# Altium schematic sheet main.SchDoc
size A4; SheetNumber: 1; SheetTotal: 1
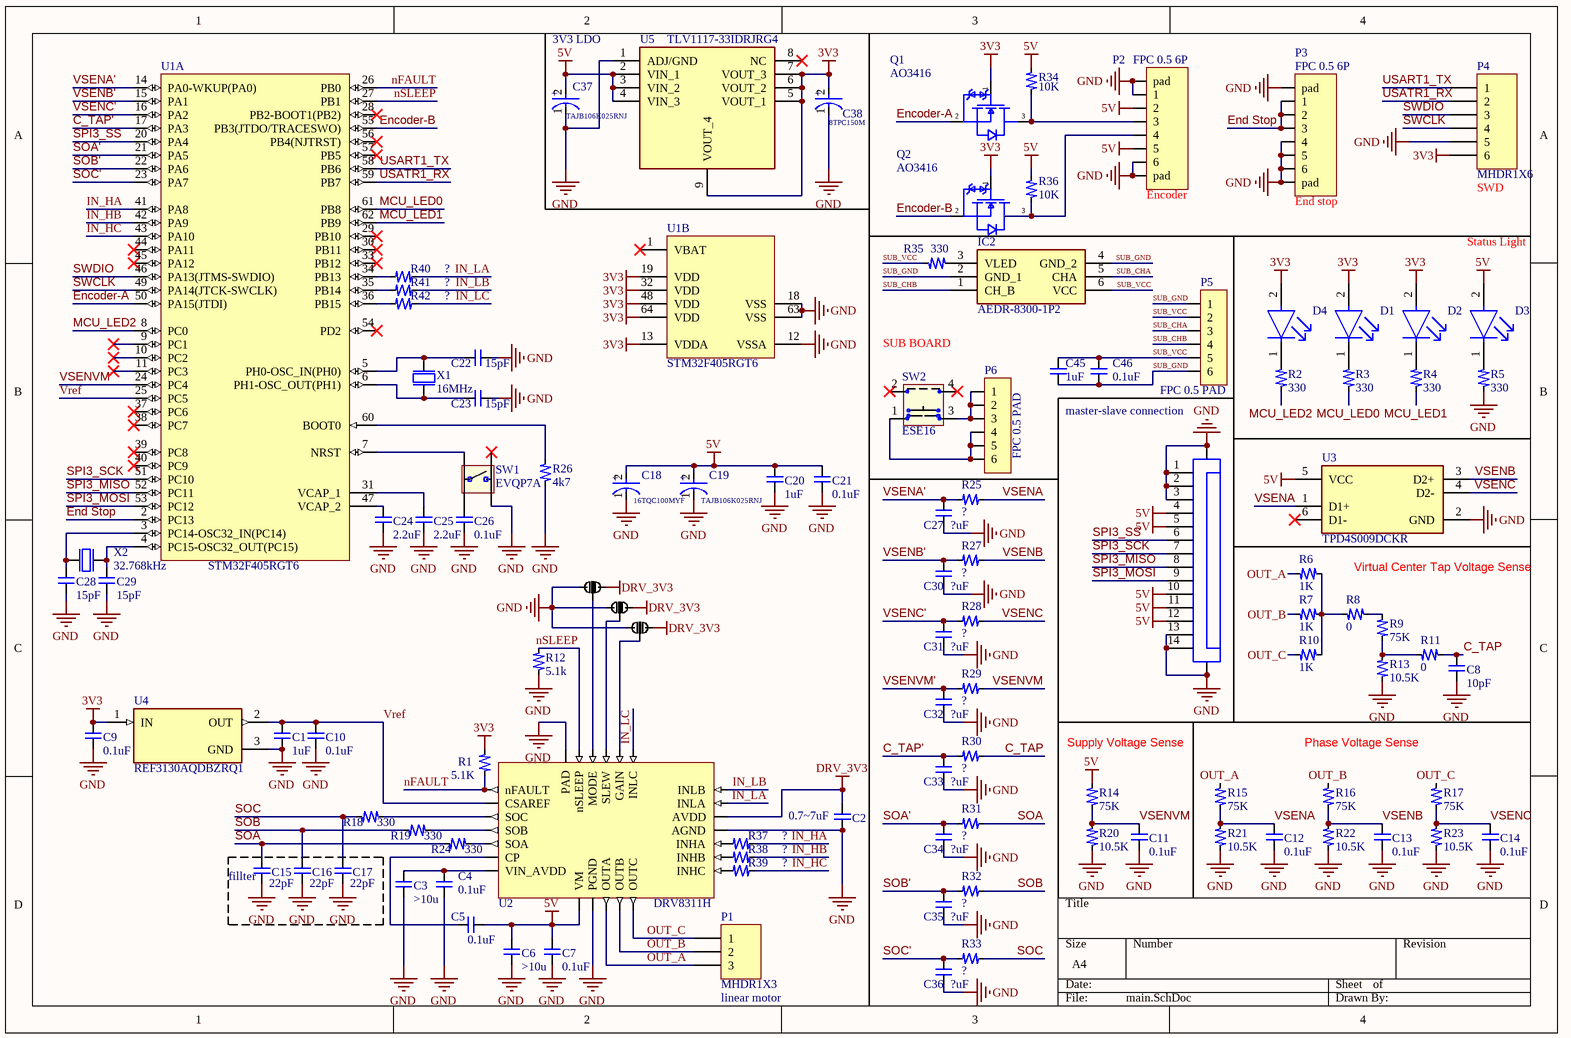
[diagram p0: main.SchDoc]

## Parts
C1  1uF  [0402 R]
C2  0.7~7uF  [0603 R]
C3  >10u  [0603 R]
C4  0.1uF  [0402 R]
C5  0.1uF  [0402 R]
C6  >10u  [0603 R]
C7  0.1uF  [0402 R]
C8  10pF  [0201 R]
C9  0.1uF  [0402 R]
C10  0.1uF  [0402 R]
C11  0.1uF  [0402 R]
C12  0.1uF  [0402 R]
C13  0.1uF  [0402 R]
C14  0.1uF  [0402 R]
C15  22pF  [0201 R]
C16  22pF  [0201 R]
C17  22pF  [0201 R]
C18  16TQC100MYF  [FP-POSCAP-D2-MFG]
C19  TAJB106K025RNJ  [FP-TAJB-MFG]
C20  1uF  [0603 R]
C21  0.1uF  [0402 R]
C22  15pF  [0201 R]
C23  15pF  [0201 R]
C24  2.2uF  [0402 R]
C25  2.2uF  [0402 R]
C26  0.1uF  [0402 R]
C27  ?uF  [0201 R]
C28  15pF  [0201 R]
C29  15pF  [0201 R]
C30  ?uF  [0201 R]
C31  ?uF  [0201 R]
C32  ?uF  [0201 R]
C33  ?uF  [0201 R]
C34  ?uF  [0201 R]
C35  ?uF  [0201 R]
C36  ?uF  [0201 R]
C37  TAJB106K025RNJ  [FP-TAJB-MFG]
C38  8TPC150M  [FP-POSCAP-D2-MFG]
C45  1uF  [0402 R]
C46  0.1uF  [0402 R]
D1  APHHS1005CGCK  [FP-APHHS1005CGCK-MFG]  (value not drawn)
D2  APHHS1005CGCK  [FP-APHHS1005CGCK-MFG]  (value not drawn)
D3  APHHS1005CGCK  [FP-APHHS1005CGCK-MFG]  (value not drawn)
D4  APHHS1005CGCK  [FP-APHHS1005CGCK-MFG]  (value not drawn)
IC2  AEDR-8300-1P2  [AEDR83001P2]
J1  68711414522  [68711414522]  (value not drawn)
P1  MHDR1X3  [MHDR1X3]
P2  FPC 0.5 6P  [FPC 6P 0.5mm]
P3  FPC 0.5 6P  [FPC 6P 0.5mm]
P4  MHDR1X6  [MHDR1X6]
P5  FPC 0.5 PAD  [FPC 6P 0.5mm PAD]
P6  FPC 0.5 PAD  [FPC 6P 0.5mm PAD]
Q1  AO3416  [SOT23-3]
Q2  AO3416  [SOT23-3]
R1  5.1K  [0201 R]
R2  330  [0402 R]
R3  330  [0402 R]
R4  330  [0402 R]
R5  330  [0402 R]
R6  1K  [0201 R]
R7  1K  [0201 R]
R8  0  [0201 R]
R9  75K  [0201 R]
R10  1K  [0201 R]
R11  0  [0201 R]
R12  5.1k  [0201 R]
R13  10.5K  [0201 R]
R14  75K  [0201 R]
R15  75K  [0201 R]
R16  75K  [0201 R]
R17  75K  [0201 R]
R18  330  [0402 R]
R19  330  [0402 R]
R20  10.5K  [0201 R]
R21  10.5K  [0201 R]
R22  10.5K  [0201 R]
R23  10.5K  [0201 R]
R24  330  [0402 R]
R25  ?  [0201 R]
R26  4k7  [0201 R]
R27  ?  [0201 R]
R28  ?  [0201 R]
R29  ?  [0201 R]
R30  ?  [0201 R]
R31  ?  [0201 R]
R32  ?  [0201 R]
R33  ?  [0201 R]
R34  10K  [0402 R]
R35  330  [0402 R]
R36  10K  [0402 R]
R37  ?  [0201 R]
R38  ?  [0201 R]
R39  ?  [0201 R]
R40  ?  [0201 R]
R41  ?  [0201 R]
R42  ?  [0201 R]
SP1  short_pad  [short_pad_3]  (value not drawn)  (part B of 2)
SP2  short_pad  [short_pad_3]  (value not drawn)  (part B of 2)
SP3  short_pad  [short_pad_3]  (value not drawn)  (part B of 2)
SW1  EVQP7A  [EVQP7A - duplicate]
SW2  ESE16  [ESE16 Switches]
U1  STM32F405RGT6  [STM-LQFP64_M]  (parts A,B of 2)
U2  DRV8311H  [WQFN24]
U3  TPD4S009DCKR  [FP-DCK0006A-MFG]
U4  REF3130AQDBZRQ1  [FP-DBZ0003A-IPC_B]
U5  TLV1117-33IDRJRG4  [SON80P400X400X80-9N-D]
X1  16MHz  [BT-XTAL_2016]
X2  32.768kHz  [XTAL_3215]

## Blocks framed on the sheet
fillter: C15-C17

## Nets
3V3: C9.1 C38.2(A) D1.2(A) D2.2(A) D4.2(A) P4.6 Q1.1(G) Q2.1(G) R1.1 U1.13(VDDA) U1.19(VDD) U1.32(VDD) U1.48(VDD) U1.64(VDD) U4.1(IN) U5.5(VOUT_1) U5.6(VOUT_2) U5.7(VOUT_3) U5.9(VOUT_4)
5V: C5.1 C6.1 C7.1 C18.2(A) C19.2(A) C20.1 C21.1 C37.2(A) D3.2(A) J1.4 J1.5 J1.10 J1.11 J1.12 P2.2 P2.5 R14.1 R34.2 R36.2 U2.8(VM) U3.5(VCC) U5.2(VIN_1) U5.3(VIN_2) U5.4(VIN_3)
DRV_3V3: C2.2 SP1.1 SP2.1 SP3.1 U2.17(AVDD)
GND: C1.2 C2.1 C3.2 C4.2 C6.2 C7.2 C8.2 C9.2 C10.2 C11.2 C12.2 C13.2 C14.2 C15.2 C16.2 C17.2 C18.1(C) C19.1(C) C20.2 C21.2 C22.2 C23.2 C24.1 C25.1 C26.1 C27.1 C28.2 C29.2 C30.1 C31.1 C32.1 C33.1 C34.1 C35.1 C36.1 C37.1(C) C38.1(C) J1.1 J1.2 J1.3 J1.13 J1.14 J1.M1 J1.M2 P2.0(pad) P2.1 P2.6 P2.7(pad) P3.0(pad) P3.4 P3.5 P3.6 P3.7(pad) P4.5 R5.1 R12.1 R13.2 R20.2 R21.2 R22.2 R23.2 R26.2 SP1.3 SP2.3 SP3.3 SW1.1 U1.12(VSSA) U1.18(VSS) U1.63(VSS) U2.9(PGND) U2.16(AGND) U2.25(PAD) U3.2(GND) U4.3(GND) U5.1(ADJ/GND) X1.2(GND) X1.4(GND)
C_TAP: C8.1 R11.2 R30.2
C_TAP': C33.2 R30.1 U1.17(PA3)
Encoder-A: Q1.2(S) U1.50(PA15(JTDI))
Encoder-B: Q2.2(S) U1.55(PB3(JTDO/TRACESWO))
End Stop: P3.1 P3.2 P3.3 U1.2(PC13)
IN_HA: R37.2 U1.41(PA8)
IN_HB: R38.2 U1.42(PA9)
IN_HC: R39.2 U1.43(PA10)
IN_LA: R40.2 U2.18(INLA)
IN_LB: R41.2 U2.19(INLB)
IN_LC: R42.2 U2.20(INLC)
MCU_LED0: R3.1 U1.61(PB8)
MCU_LED1: R4.1 U1.62(PB9)
MCU_LED2: R2.1 U1.8(PC0)
nFAULT: R1.2 U1.26(PB0) U2.1(nFAULT)
nSLEEP: R12.2 U1.27(PB1) U2.24(nSLEEP)
OUT_A: P1.3 R6.1 R15.1 U2.10(OUTA)
OUT_B: P1.2 R7.1 R16.1 U2.11(OUTB)
OUT_C: P1.1 R10.1 R17.1 U2.12(OUTC)
SOA: C15.1 R24.1 R31.2
SOA': C34.2 R31.1 U1.21(PA5)
SOB: C16.1 R19.1 R32.2
SOB': C35.2 R32.1 U1.22(PA6)
SOC: C17.1 R18.1 R33.2
SOC': C36.2 R33.1 U1.23(PA7)
SPI3_MISO: J1.8 U1.52(PC11)
SPI3_MOSI: J1.9 U1.53(PC12)
SPI3_SCK: J1.7 U1.51(PC10)
SPI3_SS: J1.6 U1.20(PA4)
SUB_CHA: IC2.5(CHA) P5.3
SUB_CHB: IC2.1(CH_B) P5.4
SUB_GND: C45.2 C46.2 IC2.2(GND_1) IC2.4(GND_2) P5.1 P5.6
SUB_VCC: C45.1 C46.1 IC2.6(VCC) P5.2 P5.5 R35.2
SWCLK: P4.4 U1.49(PA14(JTCK-SWCLK))
SWDIO: P4.3 U1.46(PA13(JTMS-SWDIO))
USART1_TX: P4.1 U1.58(PB6)
USATR1_RX: P4.2 U1.59(PB7)
Vref: C1.1 C10.1 U1.25(PC5) U2.2(CSAREF) U4.2(OUT)
VSENA: C12.1 R15.2 R21.1 R25.2 U3.1(D1+)
VSENA': C27.2 R25.1 U1.14(PA0-WKUP(PA0))
VSENB: C13.1 R16.2 R22.1 R27.2 U3.3(D2+)
VSENB': C30.2 R27.1 U1.15(PA1)
VSENC: C14.1 R17.2 R23.1 R28.2 U3.4(D2-)
VSENC': C31.2 R28.1 U1.16(PA2)
VSENVM: C11.1 R14.2 R20.1 R29.2
VSENVM': C32.2 R29.1 U1.24(PC4)
NetC3_1: C3.1 C4.1 U2.7(VIN_AVDD)
NetC5_2: C5.2 U2.6(CP)
NetC22_1: C22.1 U1.5(PH0-OSC_IN(PH0)) X1.3(out)
NetC23_1: C23.1 U1.6(PH1-OSC_OUT(PH1)) X1.1(inp)
NetC24_2: C24.2 U1.47(VCAP_2)
NetC25_2: C25.2 U1.31(VCAP_1)
NetC26_2: C26.2 SW1.4
NetC28_1: C28.1 U1.3(PC14-OSC32_IN(PC14)) X2.1(inp)
NetC29_1: C29.1 U1.4(PC15-OSC32_OUT(PC15)) X2.2(out)
NetD1_1: D1.1(C) R3.2
NetD2_1: D2.1(C) R4.2
NetD3_1: D3.1(C) R5.2
NetD4_1: D4.1(C) R2.2
NetIC2_3: IC2.3(VLED) R35.1
NetP2_3: P2.3 Q1.3(D) R34.1
NetP2_4: P2.4 Q2.3(D) R36.1
NetP6_1: P6.1 P6.2 P6.3 SW2.3(Separate_N.O)
NetP6_4: P6.4 P6.5 P6.6 SW2.1(Com_N.O)
NetR6_2: R6.2 R7.2 R8.1 R10.2
NetR8_2: R8.2 R9.1
NetR9_2: R9.2 R11.1 R13.1
NetR18_2: R18.2 U2.3(SOC)
NetR19_2: R19.2 U2.4(SOB)
NetR24_2: R24.2 U2.5(SOA)
NetR26_1: R26.1 U1.60(BOOT0)
NetR37_1: R37.1 U2.15(INHA)
NetR38_1: R38.1 U2.14(INHB)
NetR39_1: R39.1 U2.13(INHC)
NetR40_1: R40.1 U1.34(PB13)
NetR41_1: R41.1 U1.35(PB14)
NetR42_1: R42.1 U1.36(PB15)
NetSP1_2: SP1.2 U2.21(GAIN)
NetSP2_2: SP2.2 U2.23(MODE)
NetSP3_2: SP3.2 U2.22(SLEW)
NetSW1_3: SW1.3 U1.7(NRST)

Not connected (* = marked no-connect by the designer): SW1 2*; SW2 2(Dummy_N.C)* 4(Dummy_N.C)*; U1 1(VBAT)* 9(PC1)* 10(PC2)* 11(PC3)* 28(PB2-BOOT1(PB2))* 29(PB10)* 30(PB11)* 33(PB12)* 37(PC6)* 38(PC7)* 39(PC8)* 40(PC9)* 44(PA11)* 45(PA12)* 54(PD2)* 56(PB4(NJTRST))* 57(PB5)*; U3 6(D1-)*; U5 8(NC)*

## Notes on the sheet
- 3V3 LDO
- (near P2) Encoder
- (near P3) End stop
- (near P4) SWD
- Status Light
- SUB BOARD
- master-slave connection
- Virtual Center Tap Voltage Sense
- Supply Voltage Sense
- Phase Voltage Sense
- (near P1) linear motor
- (in symbol CMP-04424-000481-1) +
- (in symbol CMP-05428-000421-1) +
- (in symbol CMP-05428-000823-1) +

## Library data of the parts
C1-C5 C7-C17 C20-C36 C45 C46 = Capacitors
C6 = Capacitors: 有極性電容
C18 = CMP-05428-000823-1: Molded Tantalum Polymer Capacitor 100uF 20% 16V life 2000Hours SMD 2917; Ripple Current: 1.8A; ESR (Equivalent Series Resistance): 50mR; Dissipation Factor: 10%; Polarity: Polar; Leakage Current: 160uA; Voltage: 16V; Min Operating Temperature: -55°C; Width: 4.3mm; Package Quantity: 3000; Construction: Flat; Life (Hours): 2000Hour; Packaging: Tape and Reel; Height: 1.9mm; Radiation Hardening: No; Depth: 4.3mm; Features: General Purpose; RoHS Compliant: Yes; Voltage Rating (DC): 16V; Tolerance: 20%; Capacitance: 100uF; Case Code (Metric): 7343; Length: 7.3mm; Case Code (Imperial): 2917; Number of Pins: 2; Mount: Surface Mount; Series: POSCAP™ TQC; Height - Seated (Max): 0.079inch; Lead Free: Lead Free; Termination: SMD/SMT; REACH SVHC: No SVHC; Case/Package: 2917; Voltage Rating: 16V; Material: Polymer; Max Operating Temperature: 105°C
C19 C37 = CMP-04424-000481-1: 10uF 25V  ±10% 2.5Ω 1210  SMD Tantalum Capacitor; ESR (Equivalent Series Resistance): 2.5R; Polarity: Polar; Dissipation Factor: 6%; Leakage Current: 2.5uA; Lead Free: Lead Free; Capacitance: 10uF; Voltage Rating: 25V; Mount: Surface Mount; Packaging: Tape and Reel; Min Operating Temperature: -55°C; Weight: 0.000564oz; Series: TAJ; Case/Package: 1210; Width: 0.11inch; Height - Seated (Max): 0.083inch; RoHS Compliant: Yes; Height: 2.1mm; Depth: 2.8mm; Radiation Hardening: No; Construction: Flat; Max Operating Temperature: 125°C; Voltage Rating (DC): 25V; Features: General Purpose; REACH SVHC: No SVHC; Tolerance: 10%; Package Quantity: 1; Case Code (Metric): 3528; Termination: SMD/SMT; Case Code (Imperial): 1210; Length: 3.5mm
C38 = CMP-05428-000421-1: Molded Tantalum Polymer Capacitor 150uF 20% 8V life 2000Hours SMD 2917; Ripple Current: 1.9A; Polarity: Polar; Dissipation Factor: 10%; ESR (Equivalent Series Resistance): 40mR; Leakage Current: 120uA; Capacitance: 150uF; Voltage Rating: 8V; Tolerance: 20%; Min Operating Temperature: -55°C; Lead Free: Lead Free; Package Quantity: 3000; Packaging: Tape and Reel; Case Code (Metric): 7343; Width: 4.3mm; Case Code (Imperial): 2917; Height: 1.9mm; Height - Seated (Max): 0.079inch; Construction: Flat; Number of Pins: 2; Series: POSCAP™ TPC; REACH SVHC: No SVHC; Radiation Hardening: No; Termination: SMD/SMT; Voltage Rating (DC): 8V; Voltage: 8V; Length: 7.3mm; RoHS Compliant: Yes; Features: General Purpose; Case/Package: 2917; Depth: 4.3mm; Mount: Surface Mount; Max Operating Temperature: 105°C
D1-D4 = CMP-44529-000044-1: LED GREEN CLEAR CHIP SMD; Viewing Angle: 120°; Dominant Wavelength: 570nm; Test Current: 20mA; Luminous Intensity: 50mcd; Forward Voltage: 2.1V; Number of LEDs: 1; Lens Color: Clear; Packaging: Tape and Reel; Max Operating Temperature: 85°C; Illumination Color: Green; Length: 1mm; Mount: Surface Mount; Lens Style: Clear; Color: Green; Number of Pins: 2; Wavelength: 570nm; Case/Package: 0402; Width: 0.5mm; Package Quantity: 2000; Case Code (Metric): 1005; Height: 0.6mm; Lead Free: Lead Free; Case Code (Imperial): 0402; Forward Current: 20mA; Min Operating Temperature: -40°C
IC2 = AEDR-8300-1P2: Integrated Circuit; Manufacturer_Name: Avago Technologies; Datasheet Link: https://docs.broadcom.com/docs/AV02-0088EN; Height: 1.78mm; Manufacturer_Part_Number: AEDR-8300-1P2; Mouser Part Number: 630-AEDR-8300-1P2; Mouser Price/Stock: https://www.mouser.com/Search/Refine.aspx?Keyword=630-AEDR-8300-1P2
J1 = CMP-1502-01531-2: NexarPartId: 8917692; Contact Resistance: 20mΩ; Number of Positions: 14; Contact Location: Bottom; Operating Supply Voltage: 50V; Actuator Material: Liquid Crystal Polymer, Polymer; Pitch: 500µm; Current Rating: 500mA; Insulation Resistance: 100MΩ; Gender: Male; Number of Contacts: 14; Packaging: Tape and Reel; Number of Pins: 14; Termination: Solder; Contact Material: Bronze, Tin; Lead Pitch: 500µm; Contact Plating: Tin; Housing Material: Liquid Crystal Polymer; Flammability Rating: UL94 V-0; RoHS: Compliant; REACH SVHC: No SVHC; Orientation: Horizontal; Min Operating Temperature: -25°C; Width: 2.1mm; Max Operating Temperature: 85°C; Number of Rows: 1; Mount: Surface Mount; Length: 13.4mm; Voltage Rating: 50V
P1 = MHDR1X3: Header, 3-Pin; LatestRevisionDate: 17-Jul-2002; LatestRevisionNote: Re-released for DXP Platform.; Publisher: Altium Limited
P2 P3 = FPC_6P_0.5_Connectors
P4 = MHDR1X6: Header, 6-Pin; LatestRevisionDate: 17-Jul-2002; LatestRevisionNote: Re-released for DXP Platform.; Publisher: Altium Limited
P5 P6 = FPC_6P_0.5_PAD
R1-R42 = Resistors
SW1 = EVQP7A Side-operational Switches
SW2 = ESE16 Detector Switches
U1 = CMP-0243-00019-3: ARM Cortex-M4 32-bit MCU+FPU, 210 DMIPS, 1024 kB Flash, 192 kB Internal RAM, 51 I/Os, 64-pin LQFP, -40 to 85 degC, Tray; Manufacturer: STMicroelectronics; Supply Voltage(Vcc) min (V): 1.8; Supply Voltage(Vcc) max (V): 3.6; Internal RAM Size (kB): 192; I/Os (High Current): 51; D/A Converter: 2x12-bit; FLASH Size (Prog) (kB): 1024; Operating Frequency(F) (Processor speed) (MHz): 168; ComponentLink2Description: Datasheet; PackageVersion: Rev. 4, 06/2013; DatasheetVersion: Rev. 4; Core: ARM Cortex-M4; ComponentLink2URL: http://www.st.com/st-web-ui/static/active/en/resource/technical/document/datasheet/DM00037051.pdf; PackageReference: LQFP64; Packing: Tray; ComponentLink1Description: Manufacturer URL; ComponentLink3URL: http://www.st.com/st-web-ui/static/active/en/resource/technical/document/datasheet/DM00037051.pdf; ComponentLink3Description: Package Specification; Mounting Technology: Surface Mount; ComponentLink1URL: http://www.st.com/web/en/home.html; PackageDescription: 64-Pin Low Profile Quad Flat Package, 10 x 10 mm Body, 0.5 mm Pitch; PartNumber: STM32F405RGT6
U3 = CMP-0326-00063-4: TVS DIODE 5.5V SC70-6; Number of Channels: 4; Operating Supply Voltage: 5V; Capacitance: 0.8pF; Breakdown Voltage: 9V; Max Power Dissipation: 25W; Interface: LVDS; Direction: Unidirectional; Power Line Protection: Yes; REACH SVHC: No SVHC; Max Operating Temperature: 85°C; Length: 2mm; Number of Bidirectional Channels: 4; Weight: 8.8E-05oz; Min Breakdown Voltage: 9V; Series: -; Package Quantity: 1; Number of Pins: 6; Depth: 1.25mm; Working Voltage: 5.5V; Case/Package: SC; Radiation Hardening: No; Packaging: Tape and Reel; Reverse Standoff Voltage: 5.5V; Min Operating Temperature: -40°C; Lead Free: Lead Free; Peak Pulse Power: 25W; RoHS Compliant: Yes; Height: 0.9mm
U4 = CMP-04916-000054-1: IC VREF SERIES 0.2% SOT23-3; Case/Package: TO-236-3; Packaging: Tape and Reel; RoHS Compliant: Yes; Min Operating Temperature: -40°C; Mount: Surface Mount; Max Operating Temperature: 125°C
U5 = TLV1117-33IDRJRG4: Integrated Circuit; Manufacturer_Name: Texas Instruments; Datasheet Link: https://www.ti.com/lit/ds/symlink/tlv1117.pdf?HQS=dis-mous-null-mousermode-dsf-pf-null-wwe&ts=1631014360832&ref_url=https%253A%252F%252Fwww.mouser.co.uk%252F; Height: 0.8mm; Manufacturer_Part_Number: TLV1117-33IDRJRG4; Mouser Part Number: 595-TLV111733IDRJRG4; Mouser Price/Stock: https://www.mouser.com/Search/Refine.aspx?Keyword=595-TLV111733IDRJRG4
X1 = XTAL_SMD2016: XTAL SMD 2016, 12MHz, Cl=8pF, Total Tol: ±40ppm; Part Number: XTAL_SMD2016_32MHz_8pF_Epson; Manufacturer: Epson Toyocom; Manufacturer Part Number: Q22FA12800025; Value: 32MHz; Note: XTAL SMD 32.000MHz; Artikkelnr Noca: N.A.; Datasheet: http://www.epsondevice.com/docs/qd/en/DownloadServlet?id=ID000449; LatestRevisionDate: 2014-11-27; Pin Count: 4; Publisher: Nordic Semiconductor; Published: 2012-03-09; Supplier: Farnell; Supplier part number: 171-2806; 2nd source Supplier: *; 2nd source part number: *; Footprint Doc: XTAL_2016; Artikkelnr Simpro: N.A.
X2 = XTAL_SMD3215: XTAL SMD 3215, 32.768kHz, Cl=9pF, Total Tol: ±50ppm; Part Number: XTAL_FC-135 32.768k; Manufacturer: Epson Toyocom; Manufacturer Part Number: FC-135 32.768KHZ ±20PPM,9.0PF; 2nd source part number: 127-8037; Note: XTAL SMD 32.768kHz, 3215; Artikkelnr Noca: 22019091; Artikkelnr Simpro: N.A.; Datasheet: http://www.farnell.com/datasheets/57480.pdf; LatestRevisionDate: 2014-03-27; Pin Count: 2; Publisher: Nordic Semiconductor; Published: 2010-10-18; Value: 32.768kHz; Supplier: Digi-Key; Supplier part number: FC-135 32.7680KA-AC-ND; 2nd source Supplier: Farnell; Footprint Doc: XTAL_3215